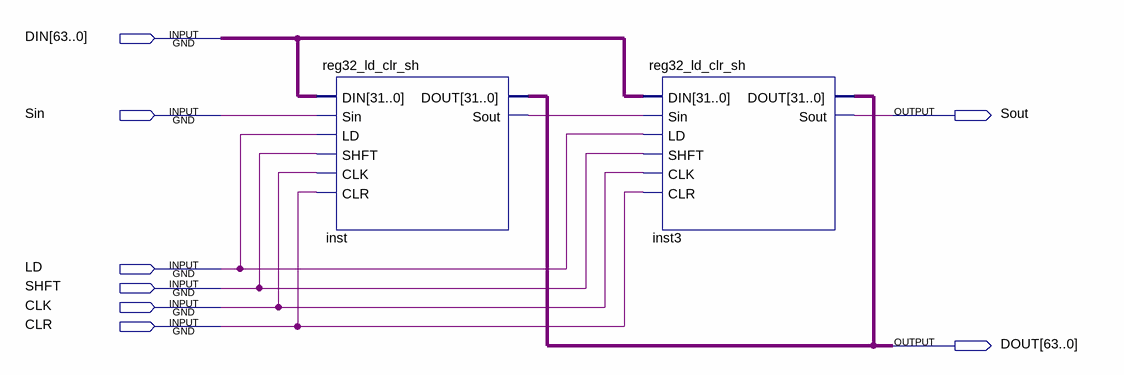
[diagram p0: schematic sheet]
// Quartus schematic reg64_ld_clr_sh.bdf as structural Verilog: 2 symbols, 8 pins
module reg64_ld_clr_sh (
  input  [63:0] DIN,
  input  Sin,
  input  LD,
  input  SHFT,
  input  CLK,
  input  CLR,
  output Sout,
  output [63:0] DOUT
);

  wire inst_sout;

  reg32_ld_clr_sh inst (
    .DIN(DIN[63:32]), .Sin(Sin), .LD(LD), .SHFT(SHFT), .CLK(CLK), .CLR(CLR), .Sout(inst_sout),
    .DOUT(DOUT[63:32]));
  reg32_ld_clr_sh inst3 (
    .DIN(DIN[31:0]), .Sin(inst_sout), .LD(LD), .SHFT(SHFT), .CLK(CLK), .CLR(CLR), .Sout(Sout),
    .DOUT(DOUT[31:0]));
endmodule
